# EAGLE board 32pins (EAGLE 6.6.0), part 1 of 3
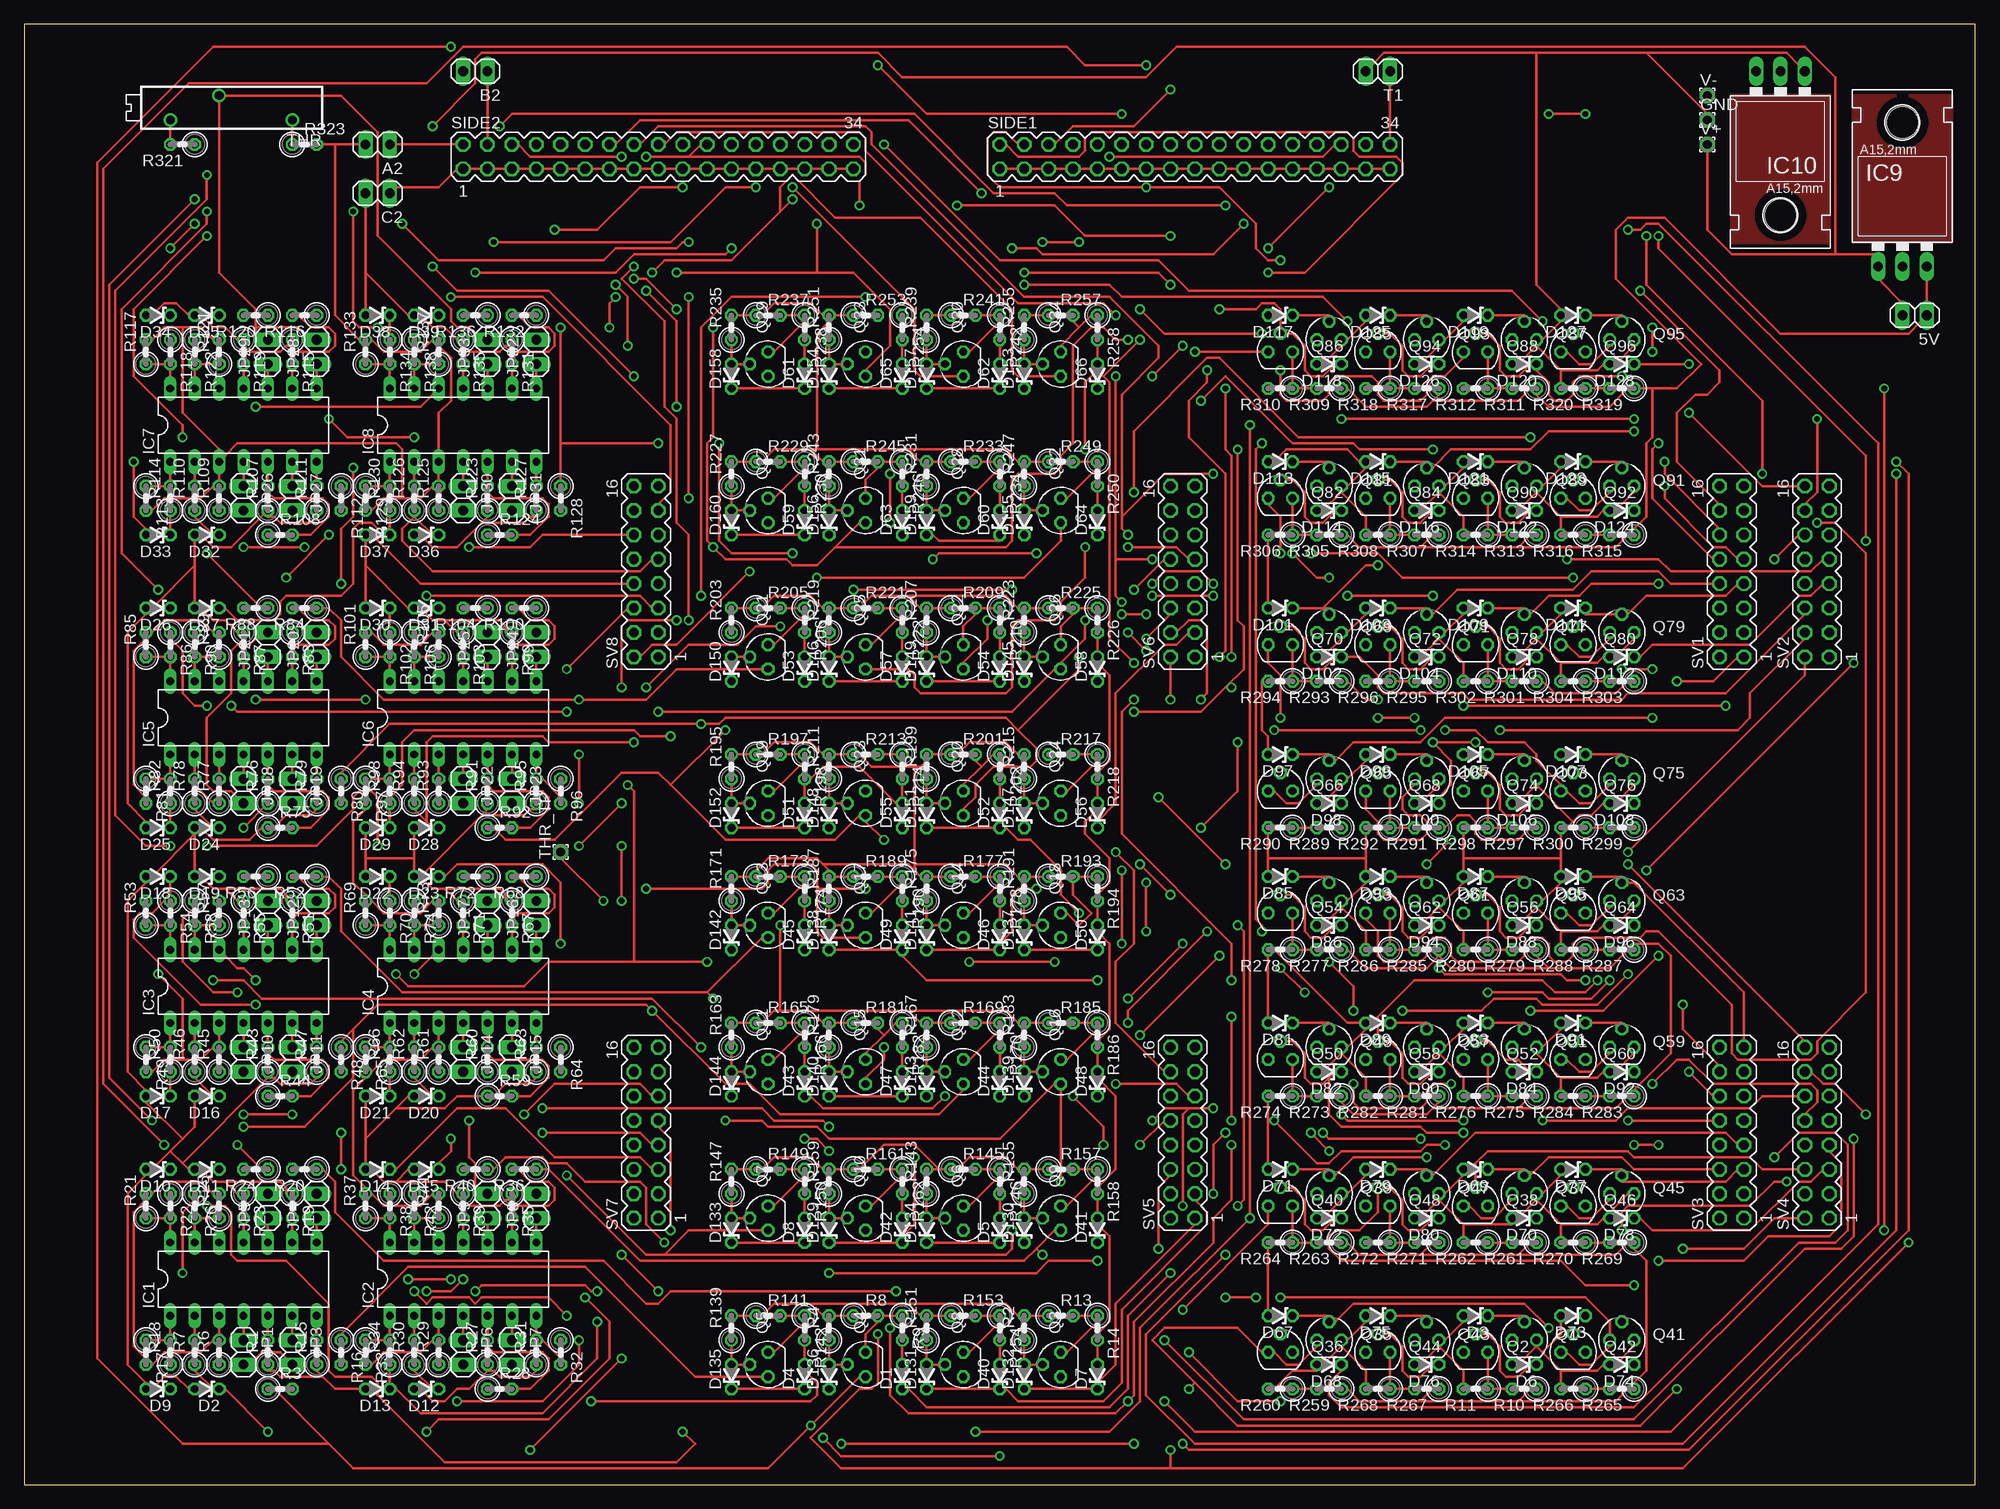
[diagram p4: board, top side]
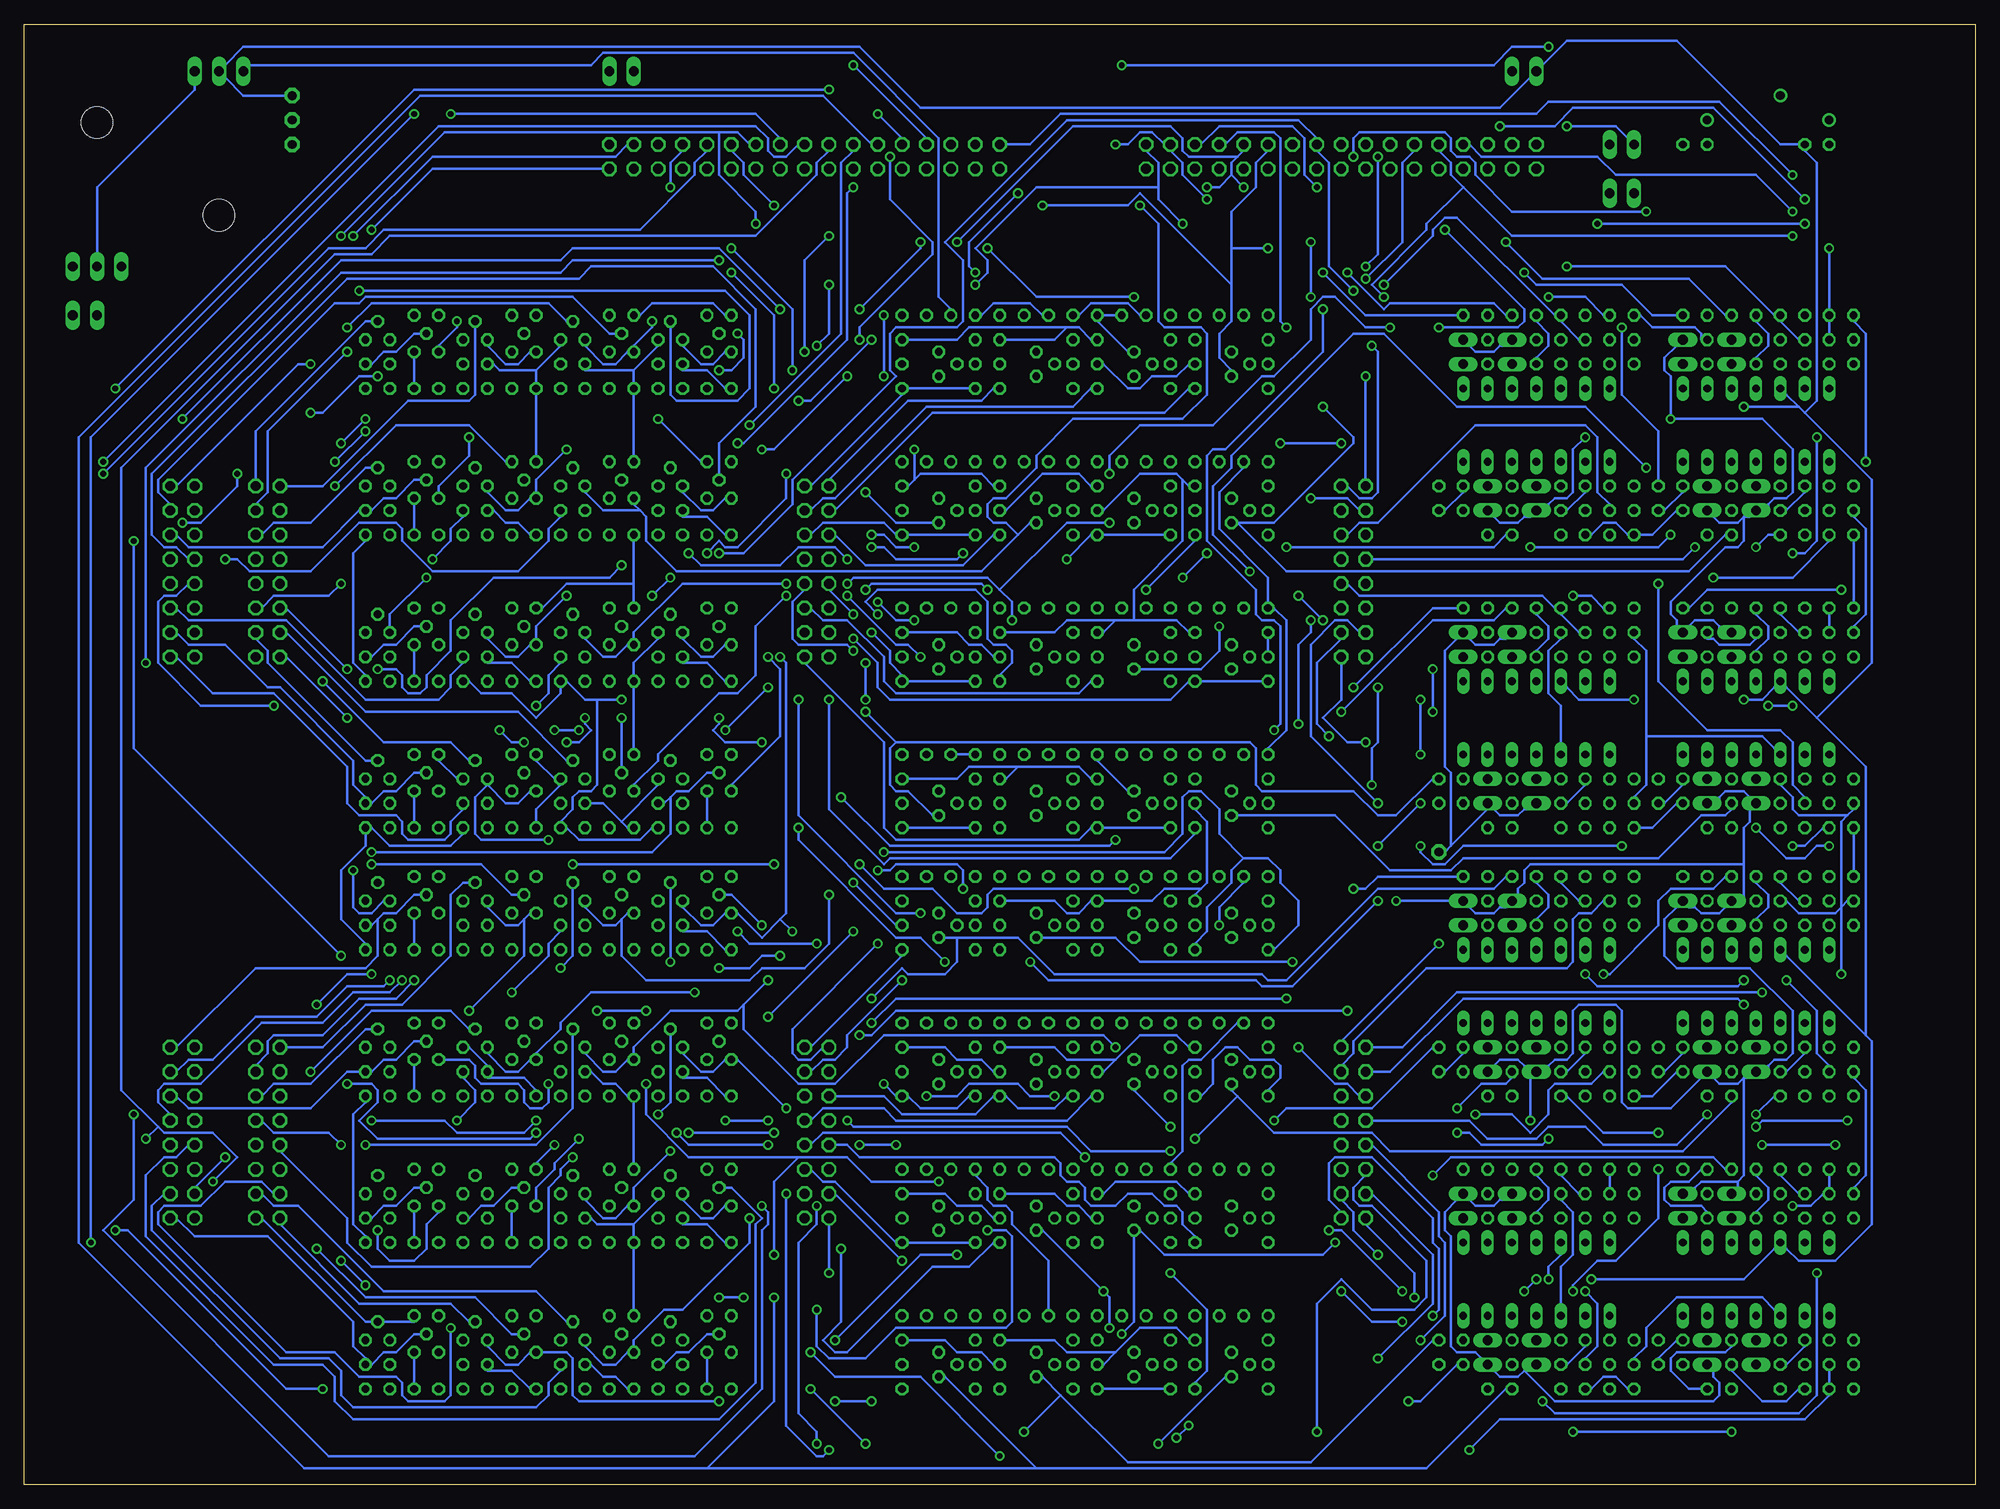
[diagram p5: board, bottom side, seen from below]

Size 203.18 x 152.07 mm. Coordinates in mm from the lower left corner, seen from the top.
Outline: 0,0 203.18,0 203.18,152.07 0,152.07 0,0
Copper layers (1*16): Top 0.035mm / dielectric 1.5mm / Bottom 0.035mm
Design rules "default": minimum track width 10mil, minimum drill 24mil, track to track 8mil, track to pad 8mil, pad to pad 8mil, via to via 8mil, smd to smd 8mil, copper to edge 40mil, drill to drill 8mil, minimum pad ring 10mil, minimum via ring 8mil, stop-mask expansion 4mil, vias tented up to drill 0mil, thermal gap 10mil

## Footprints (pad centres in the part's own frame; a part is rotated, then mirrored left to right if it is on the bottom)
1X02 = drill 1.016 long: 1 -1.27,0; 2 1.27,0
ZDIO-2.5 = drill 0.813 octagon: A 1.27,0; C -1.27,0
1,6/0,9 = drill 0.914 pad 1.6 octagon: 1 0,0
DIL14 = drill 0.813 long: 1 -7.62,-3.81; 2 -5.08,-3.81; 3 -2.54,-3.81; 4 0,-3.81; 5 2.54,-3.81; 6 5.08,-3.81; 7 7.62,-3.81; 8 7.62,3.81; 9 5.08,3.81; 10 2.54,3.81; 11 0,3.81; 12 -2.54,3.81; 13 -5.08,3.81; 14 -7.62,3.81
78XXL = drill 1.016 long: GND 0,-3.81; IN -2.54,-3.81; OUT 2.54,-3.81 | hole 3.302: 0,11.176
79XXL = drill 1.016 long: GND -2.54,-3.81; IN 0,-3.81; OUT 2.54,-3.81 | hole 3.302: 0,11.176
SOT54E = drill 0.813 octagon: D -1.27,0; G 0,1.905; S 1.27,0
0207/2V = drill 0.813 octagon: 1 -1.27,0; 2 1.27,0
MA17-2 = drill 1.016 octagon: 1 -20.32,-1.27; 2 -20.32,1.27; 3 -17.78,-1.27; 4 -17.78,1.27; 5 -15.24,-1.27; 6 -15.24,1.27; 7 -12.7,-1.27; 8 -12.7,1.27; 9 -10.16,-1.27; 10 -10.16,1.27; 11 -7.62,-1.27; 12 -7.62,1.27; 13 -5.08,-1.27; 14 -5.08,1.27; 15 -2.54,-1.27; 16 -2.54,1.27; 17 0,-1.27; 18 0,1.27; 19 2.54,-1.27; 20 2.54,1.27; 21 5.08,-1.27; 22 5.08,1.27; 23 7.62,-1.27; 24 7.62,1.27; 25 10.16,-1.27; 26 10.16,1.27; 27 12.7,-1.27; 28 12.7,1.27; 29 15.24,-1.27; 30 15.24,1.27; 31 17.78,-1.27; 32 17.78,1.27; 33 20.32,-1.27; 34 20.32,1.27
MA08-2 = drill 1.016 octagon: 1 -8.89,-1.27; 2 -8.89,1.27; 3 -6.35,-1.27; 4 -6.35,1.27; 5 -3.81,-1.27; 6 -3.81,1.27; 7 -1.27,-1.27; 8 -1.27,1.27; 9 1.27,-1.27; 10 1.27,1.27; 11 3.81,-1.27; 12 3.81,1.27; 13 6.35,-1.27; 14 6.35,1.27; 15 8.89,-1.27; 16 8.89,1.27
RTRIMT18 = drill 0.9: 1 -7.62,1.27; 2 0,-1.27; 3 5.08,1.27

## Placement (x,y rotation side)
5V  [1X02]  196.84,121.75 180 top
A2  [1X02]  36.82,139.53 180 top
B2  [1X02]  46.98,147.16 180 top
C2  [1X02]  36.82,134.46 180 top
D1  1N5229B  [ZDIO-2.5]  91.44,11.27 90 top
D2  1N5229B  [ZDIO-2.5]  19.05,10 180 top
D3  1N5229B  [ZDIO-2.5]  151.12,17.62 180 top
D4  1N5229B  [ZDIO-2.5]  81.28,11.27 90 top
D5  1N5229B  [ZDIO-2.5]  101.59,26.51 90 top
D6  1N5229B  [ZDIO-2.5]  156.21,12.54 180 top
D7  1N5229B  [ZDIO-2.5]  111.76,11.27 90 top
D8  1N5229B  [ZDIO-2.5]  81.28,26.51 90 top
D9  1N5229B  [ZDIO-2.5]  13.96,10 180 top
D10  1N5229B  [ZDIO-2.5]  13.96,32.86 180 top
D11  1N5229B  [ZDIO-2.5]  19.05,32.86 180 top
D12  1N5229B  [ZDIO-2.5]  41.9,10 180 top
D13  1N5229B  [ZDIO-2.5]  36.82,10 180 top
D14  1N5229B  [ZDIO-2.5]  36.82,32.86 180 top
D15  1N5229B  [ZDIO-2.5]  41.9,32.86 180 top
D16  1N5229B  [ZDIO-2.5]  19.05,40.48 180 top
D17  1N5229B  [ZDIO-2.5]  13.96,40.48 180 top
D18  1N5229B  [ZDIO-2.5]  13.96,63.34 180 top
D19  1N5229B  [ZDIO-2.5]  19.05,63.34 180 top
D20  1N5229B  [ZDIO-2.5]  41.9,40.48 180 top
D21  1N5229B  [ZDIO-2.5]  36.82,40.48 180 top
D22  1N5229B  [ZDIO-2.5]  36.82,63.34 180 top
D23  1N5229B  [ZDIO-2.5]  41.9,63.34 180 top
D24  1N5229B  [ZDIO-2.5]  19.05,68.41 180 top
D25  1N5229B  [ZDIO-2.5]  13.96,68.41 180 top
D26  1N5229B  [ZDIO-2.5]  13.96,91.27 180 top
D27  1N5229B  [ZDIO-2.5]  19.05,91.27 180 top
D28  1N5229B  [ZDIO-2.5]  41.9,68.41 180 top
D29  1N5229B  [ZDIO-2.5]  36.82,68.41 180 top
D30  1N5229B  [ZDIO-2.5]  36.82,91.27 180 top
D31  1N5229B  [ZDIO-2.5]  41.9,91.27 180 top
D32  1N5229B  [ZDIO-2.5]  19.05,98.89 180 top
D33  1N5229B  [ZDIO-2.5]  13.96,98.89 180 top
D34  1N5229B  [ZDIO-2.5]  13.96,121.75 180 top
D35  1N5229B  [ZDIO-2.5]  19.05,121.75 180 top
D36  1N5229B  [ZDIO-2.5]  41.9,98.89 180 top
D37  1N5229B  [ZDIO-2.5]  36.82,98.89 180 top
D38  1N5229B  [ZDIO-2.5]  36.82,121.75 180 top
D39  1N5229B  [ZDIO-2.5]  41.9,121.75 180 top
D40  1N5229B  [ZDIO-2.5]  101.59,11.27 90 top
D41  1N5229B  [ZDIO-2.5]  111.76,26.51 90 top
D42  1N5229B  [ZDIO-2.5]  91.44,26.51 90 top
D43  1N5229B  [ZDIO-2.5]  81.28,41.74 90 top
D44  1N5229B  [ZDIO-2.5]  101.59,41.74 90 top
D45  1N5229B  [ZDIO-2.5]  81.28,56.98 90 top
D46  1N5229B  [ZDIO-2.5]  101.59,56.98 90 top
D47  1N5229B  [ZDIO-2.5]  91.44,41.74 90 top
D48  1N5229B  [ZDIO-2.5]  111.76,41.74 90 top
D49  1N5229B  [ZDIO-2.5]  91.44,56.98 90 top
D50  1N5229B  [ZDIO-2.5]  111.76,56.98 90 top
D51  1N5229B  [ZDIO-2.5]  81.28,69.68 90 top
D52  1N5229B  [ZDIO-2.5]  101.59,69.68 90 top
D53  1N5229B  [ZDIO-2.5]  81.28,84.92 90 top
D54  1N5229B  [ZDIO-2.5]  101.59,84.92 90 top
D55  1N5229B  [ZDIO-2.5]  91.44,69.68 90 top
D56  1N5229B  [ZDIO-2.5]  111.76,69.68 90 top
D57  1N5229B  [ZDIO-2.5]  91.44,84.92 90 top
D58  1N5229B  [ZDIO-2.5]  111.76,84.92 90 top
D59  1N5229B  [ZDIO-2.5]  81.28,100.16 90 top
D60  1N5229B  [ZDIO-2.5]  101.59,100.16 90 top
D61  1N5229B  [ZDIO-2.5]  81.28,115.4 90 top
D62  1N5229B  [ZDIO-2.5]  101.59,115.4 90 top
D63  1N5229B  [ZDIO-2.5]  91.44,100.16 90 top
D64  1N5229B  [ZDIO-2.5]  111.76,100.16 90 top
D65  1N5229B  [ZDIO-2.5]  91.44,115.4 90 top
D66  1N5229B  [ZDIO-2.5]  111.76,115.4 90 top
D67  1N5229B  [ZDIO-2.5]  130.81,17.62 180 top
D68  1N5229B  [ZDIO-2.5]  135.88,12.54 180 top
D69  1N5229B  [ZDIO-2.5]  151.12,32.86 180 top
D70  1N5229B  [ZDIO-2.5]  156.21,27.78 180 top
D71  1N5229B  [ZDIO-2.5]  130.81,32.86 180 top
D72  1N5229B  [ZDIO-2.5]  135.88,27.78 180 top
D73  1N5229B  [ZDIO-2.5]  161.28,17.62 180 top
D74  1N5229B  [ZDIO-2.5]  166.37,12.54 180 top
D75  1N5229B  [ZDIO-2.5]  140.97,17.62 180 top
D76  1N5229B  [ZDIO-2.5]  146.05,12.54 180 top
D77  1N5229B  [ZDIO-2.5]  161.28,32.86 180 top
D78  1N5229B  [ZDIO-2.5]  166.37,27.78 180 top
D79  1N5229B  [ZDIO-2.5]  140.97,32.86 180 top
D80  1N5229B  [ZDIO-2.5]  146.05,27.78 180 top
D81  1N5229B  [ZDIO-2.5]  130.81,48.09 180 top
D82  1N5229B  [ZDIO-2.5]  135.88,43.02 180 top
D83  1N5229B  [ZDIO-2.5]  151.12,48.09 180 top
D84  1N5229B  [ZDIO-2.5]  156.21,43.02 180 top
D85  1N5229B  [ZDIO-2.5]  130.81,63.34 180 top
D86  1N5229B  [ZDIO-2.5]  135.88,58.26 180 top
D87  1N5229B  [ZDIO-2.5]  151.12,63.34 180 top
D88  1N5229B  [ZDIO-2.5]  156.21,58.26 180 top
D89  1N5229B  [ZDIO-2.5]  140.97,48.09 180 top
D90  1N5229B  [ZDIO-2.5]  146.05,43.02 180 top
D91  1N5229B  [ZDIO-2.5]  161.28,48.09 180 top
D92  1N5229B  [ZDIO-2.5]  166.37,43.02 180 top
D93  1N5229B  [ZDIO-2.5]  140.97,63.34 180 top
D94  1N5229B  [ZDIO-2.5]  146.05,58.26 180 top
D95  1N5229B  [ZDIO-2.5]  161.28,63.34 180 top
D96  1N5229B  [ZDIO-2.5]  166.37,58.26 180 top
D97  1N5229B  [ZDIO-2.5]  130.81,76.03 180 top
D98  1N5229B  [ZDIO-2.5]  135.88,70.95 180 top
D99  1N5229B  [ZDIO-2.5]  140.97,76.03 180 top
D100  1N5229B  [ZDIO-2.5]  146.05,70.95 180 top
D101  1N5229B  [ZDIO-2.5]  130.81,91.27 180 top
D102  1N5229B  [ZDIO-2.5]  135.88,86.19 180 top
D103  1N5229B  [ZDIO-2.5]  140.97,91.27 180 top
D104  1N5229B  [ZDIO-2.5]  146.05,86.19 180 top
D105  1N5229B  [ZDIO-2.5]  151.12,76.03 180 top
D106  1N5229B  [ZDIO-2.5]  156.21,70.95 180 top
D107  1N5229B  [ZDIO-2.5]  161.28,76.03 180 top
D108  1N5229B  [ZDIO-2.5]  166.37,70.95 180 top
D109  1N5229B  [ZDIO-2.5]  151.12,91.27 180 top
D110  1N5229B  [ZDIO-2.5]  156.21,86.19 180 top
D111  1N5229B  [ZDIO-2.5]  161.28,91.27 180 top
D112  1N5229B  [ZDIO-2.5]  166.37,86.19 180 top
D113  1N5229B  [ZDIO-2.5]  130.81,106.52 180 top
D114  1N5229B  [ZDIO-2.5]  135.88,101.43 180 top
D115  1N5229B  [ZDIO-2.5]  140.97,106.52 180 top
D116  1N5229B  [ZDIO-2.5]  146.05,101.43 180 top
D117  1N5229B  [ZDIO-2.5]  130.81,121.75 180 top
D118  1N5229B  [ZDIO-2.5]  135.88,116.67 180 top
D119  1N5229B  [ZDIO-2.5]  151.12,121.75 180 top
D120  1N5229B  [ZDIO-2.5]  156.21,116.67 180 top
D121  1N5229B  [ZDIO-2.5]  151.12,106.52 180 top
D122  1N5229B  [ZDIO-2.5]  156.21,101.43 180 top
D123  1N5229B  [ZDIO-2.5]  161.28,106.52 180 top
D124  1N5229B  [ZDIO-2.5]  166.37,101.43 180 top
D125  1N5229B  [ZDIO-2.5]  140.97,121.75 180 top
D126  1N5229B  [ZDIO-2.5]  146.05,116.67 180 top
D127  1N5229B  [ZDIO-2.5]  161.28,121.75 180 top
D128  1N5229B  [ZDIO-2.5]  166.37,116.67 180 top
D129  1N5225/3V  [ZDIO-2.5]  83.81,26.51 90 top
D130  1N5225/3V  [ZDIO-2.5]  104.14,26.51 90 top
D131  1N5225/3V  [ZDIO-2.5]  93.98,11.27 90 top
D132  1N5225/3V  [ZDIO-2.5]  104.14,11.27 90 top
D133  1N5225/3V  [ZDIO-2.5]  73.66,26.51 90 top
D134  1N5225/3V  [ZDIO-2.5]  93.98,26.51 90 top
D135  1N5225/3V  [ZDIO-2.5]  73.66,11.27 90 top
D136  1N5225/3V  [ZDIO-2.5]  83.81,11.27 90 top
D137  1N5225/3V  [ZDIO-2.5]  104.14,56.98 90 top
D138  1N5225/3V  [ZDIO-2.5]  83.81,56.98 90 top
D139  1N5225/3V  [ZDIO-2.5]  104.14,41.74 90 top
D140  1N5225/3V  [ZDIO-2.5]  83.81,41.74 90 top
D141  1N5225/3V  [ZDIO-2.5]  93.98,56.98 90 top
D142  1N5225/3V  [ZDIO-2.5]  73.66,56.98 90 top
D143  1N5225/3V  [ZDIO-2.5]  93.98,41.74 90 top
D144  1N5225/3V  [ZDIO-2.5]  73.66,41.74 90 top
D145  1N5225/3V  [ZDIO-2.5]  104.14,84.92 90 top
D146  1N5225/3V  [ZDIO-2.5]  83.81,84.92 90 top
D147  1N5225/3V  [ZDIO-2.5]  104.14,69.68 90 top
D148  1N5225/3V  [ZDIO-2.5]  83.81,69.68 90 top
D149  1N5225/3V  [ZDIO-2.5]  93.98,84.92 90 top
D150  1N5225/3V  [ZDIO-2.5]  73.66,84.92 90 top
D151  1N5225/3V  [ZDIO-2.5]  93.98,69.68 90 top
D152  1N5225/3V  [ZDIO-2.5]  73.66,69.68 90 top
D153  1N5225/3V  [ZDIO-2.5]  104.14,115.4 90 top
D154  1N5225/3V  [ZDIO-2.5]  83.81,115.4 90 top
D155  1N5225/3V  [ZDIO-2.5]  104.14,100.16 90 top
D156  1N5225/3V  [ZDIO-2.5]  83.81,100.16 90 top
D157  1N5225/3V  [ZDIO-2.5]  93.98,115.4 90 top
D158  1N5225/3V  [ZDIO-2.5]  73.66,115.4 90 top
D159  1N5225/3V  [ZDIO-2.5]  93.98,100.16 90 top
D160  1N5225/3V  [ZDIO-2.5]  73.66,100.16 90 top
GND  [1,6/0,9]  175.25,142.08 0 top
IC1  LM139N  [DIL14]  22.86,21.43 0 top
IC2  LM139N  [DIL14]  45.71,21.43 0 top
IC3  LM139N  [DIL14]  22.86,51.91 0 top
IC4  LM139N  [DIL14]  45.71,51.91 0 top
IC5  LM139N  [DIL14]  22.86,79.84 0 top
IC6  LM139N  [DIL14]  45.71,79.84 0 top
IC7  LM139N  [DIL14]  22.86,110.32 0 top
IC8  LM139N  [DIL14]  45.71,110.32 0 top
IC9  [78XXL]  195.58,130.65 0 top
IC10  [79XXL]  182.88,143.34 180 top
JP1  [1X02]  22.86,13.81 270 top
JP3  [1X02]  27.94,13.81 270 top
JP4  [1X02]  30.48,29.05 90 top
JP5  [1X02]  25.39,29.05 90 top
JP6  [1X02]  45.71,13.81 270 top
JP7  [1X02]  50.79,13.81 270 top
JP8  [1X02]  53.34,29.05 90 top
JP9  [1X02]  48.25,29.05 90 top
JP10  [1X02]  22.86,44.29 270 top
JP11  [1X02]  27.94,44.29 270 top
JP12  [1X02]  30.48,59.52 90 top
JP13  [1X02]  25.39,59.52 90 top
JP14  [1X02]  45.71,44.29 270 top
JP15  [1X02]  50.79,44.29 270 top
JP16  [1X02]  53.34,59.52 90 top
JP17  [1X02]  48.25,59.52 90 top
JP18  [1X02]  22.86,72.22 270 top
JP19  [1X02]  27.94,72.22 270 top
JP20  [1X02]  30.48,87.46 90 top
JP21  [1X02]  25.39,87.46 90 top
JP22  [1X02]  45.71,72.22 270 top
JP23  [1X02]  50.79,72.22 270 top
JP24  [1X02]  53.34,87.46 90 top
JP25  [1X02]  48.25,87.46 90 top
JP26  [1X02]  22.86,102.7 270 top
JP27  [1X02]  27.94,102.7 270 top
JP28  [1X02]  30.48,117.94 90 top
JP29  [1X02]  25.39,117.94 90 top
JP30  [1X02]  45.71,102.7 270 top
JP31  [1X02]  50.79,102.7 270 top
JP32  [1X02]  53.34,117.94 90 top
JP33  [1X02]  48.25,117.94 90 top
Q1  BS170  [SOT54E]  156.21,15.08 0 top
Q2  BS250  [SOT54E]  151.12,13.81 0 top
Q3  BS170  [SOT54E]  107.95,12.54 90 top
Q4  BS170  [SOT54E]  87.62,12.54 90 top
Q5  BS170  [SOT54E]  77.47,12.54 90 top
Q6  BS170  [SOT54E]  97.79,27.78 90 top
Q7  BS170  [SOT54E]  77.47,27.78 90 top
Q8  BS170  [SOT54E]  97.79,12.54 90 top
Q9  BS170  [SOT54E]  107.95,27.78 90 top
Q10  BS170  [SOT54E]  87.62,27.78 90 top
Q11  BS170  [SOT54E]  77.47,43.02 90 top
Q12  BS170  [SOT54E]  97.79,43.02 90 top
Q13  BS170  [SOT54E]  77.47,58.26 90 top
Q14  BS170  [SOT54E]  97.79,58.26 90 top
Q15  BS170  [SOT54E]  87.62,43.02 90 top
Q16  BS170  [SOT54E]  107.95,43.02 90 top
Q17  BS170  [SOT54E]  87.62,58.26 90 top
Q18  BS170  [SOT54E]  107.95,58.26 90 top
Q19  BS170  [SOT54E]  77.47,70.95 90 top
Q20  BS170  [SOT54E]  97.79,70.95 90 top
Q21  BS170  [SOT54E]  77.47,86.19 90 top
Q22  BS170  [SOT54E]  97.79,86.19 90 top
Q23  BS170  [SOT54E]  87.62,70.95 90 top
Q24  BS170  [SOT54E]  107.95,70.95 90 top
Q25  BS170  [SOT54E]  87.62,86.19 90 top
Q26  BS170  [SOT54E]  107.95,86.19 90 top
Q27  BS170  [SOT54E]  77.47,101.43 90 top
Q28  BS170  [SOT54E]  97.79,101.43 90 top
Q29  BS170  [SOT54E]  77.47,116.67 90 top
Q30  BS170  [SOT54E]  97.79,116.67 90 top
Q31  BS170  [SOT54E]  87.62,101.43 90 top
Q32  BS170  [SOT54E]  107.95,101.43 90 top
Q33  BS170  [SOT54E]  87.62,116.67 90 top
Q34  BS170  [SOT54E]  107.95,116.67 90 top
Q35  BS170  [SOT54E]  135.88,15.08 0 top
Q36  BS250  [SOT54E]  130.81,13.81 0 top
Q37  BS170  [SOT54E]  156.21,30.32 0 top
Q38  BS250  [SOT54E]  151.12,29.05 0 top
Q39  BS170  [SOT54E]  135.88,30.32 0 top
Q40  BS250  [SOT54E]  130.81,29.05 0 top
Q41  BS170  [SOT54E]  166.37,15.08 0 top
Q42  BS250  [SOT54E]  161.28,13.81 0 top
Q43  BS170  [SOT54E]  146.05,15.08 0 top
Q44  BS250  [SOT54E]  140.97,13.81 0 top
Q45  BS170  [SOT54E]  166.37,30.32 0 top
Q46  BS250  [SOT54E]  161.28,29.05 0 top
Q47  BS170  [SOT54E]  146.05,30.32 0 top
Q48  BS250  [SOT54E]  140.97,29.05 0 top
Q49  BS170  [SOT54E]  135.88,45.55 0 top
Q50  BS250  [SOT54E]  130.81,44.29 0 top
Q51  BS170  [SOT54E]  156.21,45.55 0 top
Q52  BS250  [SOT54E]  151.12,44.29 0 top
Q53  BS170  [SOT54E]  135.88,60.8 0 top
Q54  BS250  [SOT54E]  130.81,59.52 0 top
Q55  BS170  [SOT54E]  156.21,60.8 0 top
Q56  BS250  [SOT54E]  151.12,59.52 0 top
Q57  BS170  [SOT54E]  146.05,45.55 0 top
Q58  BS250  [SOT54E]  140.97,44.29 0 top
Q59  BS170  [SOT54E]  166.37,45.55 0 top
Q60  BS250  [SOT54E]  161.28,44.29 0 top
Q61  BS170  [SOT54E]  146.05,60.8 0 top
Q62  BS250  [SOT54E]  140.97,59.52 0 top
Q63  BS170  [SOT54E]  166.37,60.8 0 top
Q64  BS250  [SOT54E]  161.28,59.52 0 top
Q65  BS170  [SOT54E]  135.88,73.49 0 top
Q66  BS250  [SOT54E]  130.81,72.22 0 top
Q67  BS170  [SOT54E]  146.05,73.49 0 top
Q68  BS250  [SOT54E]  140.97,72.22 0 top
Q69  BS170  [SOT54E]  135.88,88.73 0 top
Q70  BS250  [SOT54E]  130.81,87.46 0 top
Q71  BS170  [SOT54E]  146.05,88.73 0 top
Q72  BS250  [SOT54E]  140.97,87.46 0 top
Q73  BS170  [SOT54E]  156.21,73.49 0 top
Q74  BS250  [SOT54E]  151.12,72.22 0 top
Q75  BS170  [SOT54E]  166.37,73.49 0 top
Q76  BS250  [SOT54E]  161.28,72.22 0 top
Q77  BS170  [SOT54E]  156.21,88.73 0 top
Q78  BS250  [SOT54E]  151.12,87.46 0 top
Q79  BS170  [SOT54E]  166.37,88.73 0 top
Q80  BS250  [SOT54E]  161.28,87.46 0 top
Q81  BS170  [SOT54E]  135.88,103.97 0 top
Q82  BS250  [SOT54E]  130.81,102.7 0 top
Q83  BS170  [SOT54E]  146.05,103.97 0 top
Q84  BS250  [SOT54E]  140.97,102.7 0 top
Q85  BS170  [SOT54E]  135.88,119.21 0 top
Q86  BS250  [SOT54E]  130.81,117.94 0 top
Q87  BS170  [SOT54E]  156.21,119.21 0 top
Q88  BS250  [SOT54E]  151.12,117.94 0 top
Q89  BS170  [SOT54E]  156.21,103.97 0 top
Q90  BS250  [SOT54E]  151.12,102.7 0 top
Q91  BS170  [SOT54E]  166.37,103.97 0 top
Q92  BS250  [SOT54E]  161.28,102.7 0 top
Q93  BS170  [SOT54E]  146.05,119.21 0 top
Q94  BS250  [SOT54E]  140.97,117.94 0 top
Q95  BS170  [SOT54E]  166.37,119.21 0 top
Q96  BS250  [SOT54E]  161.28,117.94 0 top
R1  27K  [0207/2V]  25.39,13.81 90 top
R2  5K  [0207/2V]  104.14,16.35 90 top
R3  75K  [0207/2V]  26.67,10 0 top
R4  5K  [0207/2V]  83.81,16.35 90 top
R6  5K  [0207/2V]  20.32,13.81 90 top
R7  5K  [0207/2V]  17.78,13.81 90 top
R8  5K  [0207/2V]  87.62,17.62 0 top
R9  10K  [0207/2V]  91.44,16.35 270 top
R10  5K  [0207/2V]  156.21,10 180 top
R11  10K  [0207/2V]  151.12,10 180 top
R13  5K  [0207/2V]  107.95,17.62 0 top
R14  10K  [0207/2V]  111.76,16.35 270 top
R15  27K  [0207/2V]  30.48,13.81 90 top
R16  75K  [0207/2V]  33.02,13.81 270 top
R17  5K  [0207/2V]  12.69,13.81 270 top
R18  5K  [0207/2V]  15.23,13.81 90 top
R19  27K  [0207/2V]  27.94,29.05 270 top
R20  75K  [0207/2V]  29.21,32.86 180 top
R21  5K  [0207/2V]  12.69,29.05 90 top
R22  5K  [0207/2V]  15.23,29.05 270 top
R23  27K  [0207/2V]  22.86,29.05 270 top
R24  75K  [0207/2V]  24.12,32.86 180 top
R25  5K  [0207/2V]  20.32,29.05 90 top
R26  5K  [0207/2V]  17.78,29.05 270 top
R27  27K  [0207/2V]  48.25,13.81 90 top
R28  75K  [0207/2V]  49.52,10 0 top
R29  5K  [0207/2V]  43.17,13.81 90 top
R30  5K  [0207/2V]  40.63,13.81 90 top
R31  27K  [0207/2V]  53.34,13.81 90 top
R32  75K  [0207/2V]  55.88,13.81 270 top
R33  5K  [0207/2V]  35.55,13.81 270 top
R34  5K  [0207/2V]  38.09,13.81 90 top
R35  27K  [0207/2V]  50.79,29.05 270 top
R36  75K  [0207/2V]  52.06,32.86 180 top
R37  5K  [0207/2V]  35.55,29.05 90 top
R38  5K  [0207/2V]  38.09,29.05 270 top
R39  27K  [0207/2V]  45.71,29.05 270 top
R40  75K  [0207/2V]  46.98,32.86 180 top
R41  5K  [0207/2V]  43.17,29.05 90 top
R42  5K  [0207/2V]  40.63,29.05 270 top
R43  27K  [0207/2V]  25.39,44.29 90 top
R44  75K  [0207/2V]  26.67,40.48 0 top
R45  5K  [0207/2V]  20.32,44.29 90 top
R46  5K  [0207/2V]  17.78,44.29 90 top
R47  27K  [0207/2V]  30.48,44.29 90 top
R48  75K  [0207/2V]  33.02,44.29 270 top
R49  5K  [0207/2V]  12.69,44.29 270 top
R50  5K  [0207/2V]  15.23,44.29 90 top
R51  27K  [0207/2V]  27.94,59.52 270 top
R52  75K  [0207/2V]  29.21,63.34 180 top
R53  5K  [0207/2V]  12.69,59.52 90 top
R54  5K  [0207/2V]  15.23,59.52 270 top
R55  27K  [0207/2V]  22.86,59.52 270 top
R56  75K  [0207/2V]  24.12,63.34 180 top
R57  5K  [0207/2V]  20.32,59.52 90 top
R58  5K  [0207/2V]  17.78,59.52 270 top
R59  27K  [0207/2V]  49.52,40.48 0 top
R60  75K  [0207/2V]  48.25,44.29 90 top
R61  5K  [0207/2V]  43.17,44.29 90 top
R62  5K  [0207/2V]  40.63,44.29 90 top
R63  27K  [0207/2V]  53.34,44.29 90 top
R64  75K  [0207/2V]  55.88,44.29 270 top
R65  5K  [0207/2V]  35.55,44.29 270 top
R66  5K  [0207/2V]  38.09,44.29 90 top
R67  27K  [0207/2V]  50.79,59.52 270 top
R68  75K  [0207/2V]  52.06,63.34 180 top
R69  5K  [0207/2V]  35.55,59.52 90 top
R70  5K  [0207/2V]  38.09,59.52 270 top
R71  27K  [0207/2V]  45.71,59.52 270 top
R72  75K  [0207/2V]  46.98,63.34 180 top
R73  5K  [0207/2V]  43.17,59.52 90 top
R74  5K  [0207/2V]  40.63,59.52 270 top
R75  27K  [0207/2V]  26.67,68.41 0 top
R76  75K  [0207/2V]  25.39,72.22 90 top
R77  5K  [0207/2V]  20.32,72.22 90 top
R78  5K  [0207/2V]  17.78,72.22 90 top
R79  27K  [0207/2V]  30.48,72.22 90 top
R80  75K  [0207/2V]  33.02,72.22 270 top
R81  5K  [0207/2V]  12.69,72.22 270 top
R82  5K  [0207/2V]  15.23,72.22 90 top
R83  27K  [0207/2V]  27.94,87.46 270 top
R84  75K  [0207/2V]  29.21,91.27 180 top
R85  5K  [0207/2V]  12.69,87.46 90 top
R86  5K  [0207/2V]  15.23,87.46 270 top
R87  27K  [0207/2V]  22.86,87.46 270 top
R88  75K  [0207/2V]  24.12,91.27 180 top
R89  5K  [0207/2V]  20.32,87.46 90 top
R90  5K  [0207/2V]  17.78,87.46 270 top
R91  27K  [0207/2V]  48.25,72.22 90 top
R92  75K  [0207/2V]  49.52,68.41 0 top
R93  5K  [0207/2V]  43.17,72.22 90 top
R94  5K  [0207/2V]  40.63,72.22 90 top
R95  27K  [0207/2V]  53.34,72.22 90 top
R96  75K  [0207/2V]  55.88,72.22 270 top
R97  5K  [0207/2V]  35.55,72.22 270 top
R98  5K  [0207/2V]  38.09,72.22 90 top
R99  27K  [0207/2V]  50.79,87.46 270 top
R100  75K  [0207/2V]  52.06,91.27 180 top
R101  5K  [0207/2V]  35.55,87.46 90 top
R102  5K  [0207/2V]  38.09,87.46 270 top
R103  27K  [0207/2V]  45.71,87.46 270 top
R104  75K  [0207/2V]  46.98,91.27 180 top
R105  5K  [0207/2V]  43.17,87.46 90 top
R106  5K  [0207/2V]  40.63,87.46 270 top
R107  27K  [0207/2V]  25.39,102.7 90 top
R108  75K  [0207/2V]  26.67,98.89 0 top
R109  5K  [0207/2V]  20.32,102.7 90 top
R110  5K  [0207/2V]  17.78,102.7 90 top
R111  27K  [0207/2V]  30.48,102.7 90 top
R112  75K  [0207/2V]  33.02,102.7 270 top
R113  5K  [0207/2V]  12.69,102.7 270 top
R114  5K  [0207/2V]  15.23,102.7 90 top
R115  27K  [0207/2V]  27.94,117.94 270 top
R116  75K  [0207/2V]  29.21,121.75 180 top
R117  5K  [0207/2V]  12.69,117.94 90 top
R118  5K  [0207/2V]  15.23,117.94 270 top
R119  27K  [0207/2V]  22.86,117.94 270 top
R120  75K  [0207/2V]  24.12,121.75 180 top
R121  5K  [0207/2V]  20.32,117.94 90 top
R122  5K  [0207/2V]  17.78,117.94 270 top
R123  27K  [0207/2V]  48.25,102.7 90 top
R124  75K  [0207/2V]  49.52,98.89 0 top
R125  5K  [0207/2V]  43.17,102.7 90 top
R126  5K  [0207/2V]  40.63,102.7 90 top
R127  27K  [0207/2V]  53.34,102.7 90 top
R128  75K  [0207/2V]  55.88,102.7 270 top
R129  5K  [0207/2V]  35.55,102.7 270 top
R130  5K  [0207/2V]  38.09,102.7 90 top
R131  27K  [0207/2V]  50.79,117.94 270 top
R132  75K  [0207/2V]  52.06,121.75 180 top
R133  5K  [0207/2V]  35.55,117.94 90 top
R134  5K  [0207/2V]  38.09,117.94 270 top
R135  27K  [0207/2V]  45.71,117.94 270 top
R136  75K  [0207/2V]  46.98,121.75 180 top
R137  5K  [0207/2V]  43.17,117.94 90 top
R138  5K  [0207/2V]  40.63,117.94 270 top
R139  5K  [0207/2V]  73.66,16.35 90 top
R141  5K  [0207/2V]  77.47,17.62 0 top
R142  10K  [0207/2V]  81.28,16.35 270 top
R143  5K  [0207/2V]  93.98,31.59 90 top
R145  5K  [0207/2V]  97.79,32.86 0 top
R146  10K  [0207/2V]  101.59,31.59 270 top
R147  5K  [0207/2V]  73.66,31.59 90 top
R149  5K  [0207/2V]  77.47,32.86 0 top
R150  10K  [0207/2V]  81.28,31.59 270 top
R151  5K  [0207/2V]  93.98,16.35 90 top
R153  5K  [0207/2V]  97.79,17.62 0 top
R154  10K  [0207/2V]  101.59,16.35 270 top
R155  5K  [0207/2V]  104.14,31.59 90 top
R157  5K  [0207/2V]  107.95,32.86 0 top
R158  10K  [0207/2V]  111.76,31.59 270 top
R159  5K  [0207/2V]  83.81,31.59 90 top
R161  5K  [0207/2V]  87.62,32.86 0 top
R162  10K  [0207/2V]  91.44,31.59 270 top
R163  5K  [0207/2V]  73.66,46.83 90 top
R165  5K  [0207/2V]  77.47,48.09 0 top
R166  10K  [0207/2V]  81.28,46.83 270 top
R167  5K  [0207/2V]  93.98,46.83 90 top
R169  5K  [0207/2V]  97.79,48.09 0 top
R170  10K  [0207/2V]  101.59,46.83 270 top
R171  5K  [0207/2V]  73.66,62.06 90 top
R173  5K  [0207/2V]  77.47,63.34 0 top
R174  10K  [0207/2V]  81.28,62.06 270 top
R175  5K  [0207/2V]  93.98,62.06 90 top
R177  5K  [0207/2V]  97.79,63.34 0 top
R178  10K  [0207/2V]  101.59,62.06 270 top
R179  5K  [0207/2V]  83.81,46.83 90 top
R181  5K  [0207/2V]  87.62,48.09 0 top
R182  10K  [0207/2V]  91.44,46.83 270 top
R183  5K  [0207/2V]  104.14,46.83 90 top
R185  5K  [0207/2V]  107.95,48.09 0 top
R186  10K  [0207/2V]  111.76,46.83 270 top
R187  5K  [0207/2V]  83.81,62.06 90 top
R189  5K  [0207/2V]  87.62,63.34 0 top
R190  10K  [0207/2V]  91.44,62.06 270 top
R191  5K  [0207/2V]  104.14,62.06 90 top
R193  5K  [0207/2V]  107.95,63.34 0 top
R194  10K  [0207/2V]  111.76,62.06 270 top
R195  5K  [0207/2V]  73.66,74.77 90 top
R197  5K  [0207/2V]  77.47,76.03 0 top
R198  10K  [0207/2V]  81.28,74.77 270 top
R199  5K  [0207/2V]  93.98,74.77 90 top
R201  5K  [0207/2V]  97.79,76.03 0 top
R202  10K  [0207/2V]  101.59,74.77 270 top
R203  5K  [0207/2V]  73.66,90 90 top
R205  5K  [0207/2V]  77.47,91.27 0 top
R206  10K  [0207/2V]  81.28,90 270 top
R207  5K  [0207/2V]  93.98,90 90 top
R209  5K  [0207/2V]  97.79,91.27 0 top
R210  10K  [0207/2V]  101.59,90 270 top
R211  5K  [0207/2V]  83.81,74.77 90 top
R213  5K  [0207/2V]  87.62,76.03 0 top
R214  10K  [0207/2V]  91.44,74.77 270 top
R215  5K  [0207/2V]  104.14,74.77 90 top
R217  5K  [0207/2V]  107.95,76.03 0 top
R218  10K  [0207/2V]  111.76,74.77 270 top
R219  5K  [0207/2V]  83.81,90 90 top
R221  5K  [0207/2V]  87.62,91.27 0 top
R222  10K  [0207/2V]  91.44,90 270 top
R223  5K  [0207/2V]  104.14,90 90 top
R225  5K  [0207/2V]  107.95,91.27 0 top
R226  10K  [0207/2V]  111.76,90 270 top
R227  5K  [0207/2V]  73.66,105.24 90 top
R229  5K  [0207/2V]  77.47,106.52 0 top
R230  10K  [0207/2V]  81.28,105.24 270 top
R231  5K  [0207/2V]  93.98,105.24 90 top
R233  5K  [0207/2V]  97.79,106.52 0 top
R234  10K  [0207/2V]  101.59,105.24 270 top
R235  5K  [0207/2V]  73.66,120.48 90 top
R237  5K  [0207/2V]  77.47,121.75 0 top
R238  10K  [0207/2V]  81.28,120.48 270 top
R239  5K  [0207/2V]  93.98,120.48 90 top
R241  5K  [0207/2V]  97.79,121.75 0 top
R242  10K  [0207/2V]  101.59,120.48 270 top
R243  5K  [0207/2V]  83.81,105.24 90 top
R245  5K  [0207/2V]  87.62,106.52 0 top
R246  10K  [0207/2V]  91.44,105.24 270 top
R247  5K  [0207/2V]  104.14,105.24 90 top
R249  5K  [0207/2V]  107.95,106.52 0 top
R250  10K  [0207/2V]  111.76,105.24 270 top
R251  5K  [0207/2V]  83.81,120.48 90 top
R253  5K  [0207/2V]  87.62,121.75 0 top
R254  10K  [0207/2V]  91.44,120.48 270 top
R255  5K  [0207/2V]  104.14,120.48 90 top
R257  5K  [0207/2V]  107.95,121.75 0 top
R258  10K  [0207/2V]  111.76,120.48 270 top
R259  5K  [0207/2V]  135.88,10 180 top
R260  10K  [0207/2V]  130.81,10 180 top
R261  5K  [0207/2V]  156.21,25.23 180 top
R262  10K  [0207/2V]  151.12,25.23 180 top
R263  5K  [0207/2V]  135.88,25.23 180 top
R264  10K  [0207/2V]  130.81,25.23 180 top
R265  5K  [0207/2V]  166.37,10 180 top
R266  10K  [0207/2V]  161.28,10 180 top
R267  5K  [0207/2V]  146.05,10 180 top
R268  10K  [0207/2V]  140.97,10 180 top
R269  5K  [0207/2V]  166.37,25.23 180 top
R270  10K  [0207/2V]  161.28,25.23 180 top
R271  5K  [0207/2V]  146.05,25.23 180 top
R272  10K  [0207/2V]  140.97,25.23 180 top
R273  5K  [0207/2V]  135.88,40.48 180 top
R274  10K  [0207/2V]  130.81,40.48 180 top
R275  5K  [0207/2V]  156.21,40.48 180 top
R276  10K  [0207/2V]  151.12,40.48 180 top
R277  5K  [0207/2V]  135.88,55.72 180 top
R278  10K  [0207/2V]  130.81,55.72 180 top
R279  5K  [0207/2V]  156.21,55.72 180 top
R280  10K  [0207/2V]  151.12,55.72 180 top
R281  5K  [0207/2V]  146.05,40.48 180 top
R282  10K  [0207/2V]  140.97,40.48 180 top
R283  5K  [0207/2V]  166.37,40.48 180 top
R284  10K  [0207/2V]  161.28,40.48 180 top
R285  5K  [0207/2V]  146.05,55.72 180 top
R286  10K  [0207/2V]  140.97,55.72 180 top
R287  5K  [0207/2V]  166.37,55.72 180 top
R288  10K  [0207/2V]  161.28,55.72 180 top
R289  5K  [0207/2V]  135.88,68.41 180 top
R290  10K  [0207/2V]  130.81,68.41 180 top
R291  5K  [0207/2V]  146.05,68.41 180 top
R292  10K  [0207/2V]  140.97,68.41 180 top
R293  5K  [0207/2V]  135.88,83.65 180 top
R294  10K  [0207/2V]  130.81,83.65 180 top
R295  5K  [0207/2V]  146.05,83.65 180 top
R296  10K  [0207/2V]  140.97,83.65 180 top
R297  5K  [0207/2V]  156.21,68.41 180 top
R298  10K  [0207/2V]  151.12,68.41 180 top
R299  5K  [0207/2V]  166.37,68.41 180 top
R300  10K  [0207/2V]  161.28,68.41 180 top
R301  5K  [0207/2V]  156.21,83.65 180 top
R302  10K  [0207/2V]  151.12,83.65 180 top
R303  5K  [0207/2V]  166.37,83.65 180 top
R304  10K  [0207/2V]  161.28,83.65 180 top
R305  5K  [0207/2V]  135.88,98.89 180 top
R306  10K  [0207/2V]  130.81,98.89 180 top
R307  5K  [0207/2V]  146.05,98.89 180 top
R308  10K  [0207/2V]  140.97,98.89 180 top
R309  5K  [0207/2V]  135.88,114.13 180 top
R310  10K  [0207/2V]  130.81,114.13 180 top
R311  5K  [0207/2V]  156.21,114.13 180 top
R312  10K  [0207/2V]  151.12,114.13 180 top
R313  5K  [0207/2V]  156.21,98.89 180 top
R314  10K  [0207/2V]  151.12,98.89 180 top
R315  5K  [0207/2V]  166.37,98.89 180 top
R316  10K  [0207/2V]  161.28,98.89 180 top
R317  5K  [0207/2V]  146.05,114.13 180 top
R318  10K  [0207/2V]  140.97,114.13 180 top
R319  5K  [0207/2V]  166.37,114.13 180 top
R320  10K  [0207/2V]  161.28,114.13 180 top
R321  [0207/2V]  16.51,139.53 180 top
R323  [0207/2V]  29.21,139.53 0 top
SIDE1  [MA17-2]  121.92,138.27 0 top
SIDE2  [MA17-2]  66.04,138.27 0 top
SV1  [MA08-2]  177.8,95.08 90 top
SV2  [MA08-2]  186.69,95.08 90 top
SV3  [MA08-2]  177.8,36.66 90 top
SV4  [MA08-2]  186.69,36.66 90 top
SV5  [MA08-2]  120.65,36.66 90 top
SV6  [MA08-2]  120.65,95.08 90 top
SV7  [MA08-2]  64.77,36.66 90 top
SV8  [MA08-2]  64.77,95.08 90 top
T1  [1X02]  140.97,147.16 180 top
THR  [RTRIMT18]  20.32,143.34 180 top
THR_TP  [1,6/0,9]  55.88,65.88 90 top
V+  [1,6/0,9]  175.25,139.53 0 top
V-  [1,6/0,9]  175.25,144.62 0 top

## Tracks (layer width: path | path; a pad name or v marks a point on that pad's centre or on a via)
!PUA1  (via drill 0.61)
  Top 0.254: Q2.G 151.76,15.71 152.4,15.71 153.66,14.44 153.66,11.9 154.3,11.27 155.57,11.27 156.84,12.54 D6.C | v172.72,24.6 179.06,24.6 182.24,27.78 184.78,27.78 SV4.2
  Bottom 0.254: v172.72,24.6 167.63,19.52 156.21,19.52 152.4,15.71 151.76,15.71 Q2.G
!PUB1  (via drill 0.61)
  Top 0.254: v182.24,34.12 184.78,36.66 188.59,36.66 189.86,35.4 189.86,26.51 188.59,25.23 184.78,25.23 167.63,8.09 137.16,8.09 135.88,9.36 135.88,10.63 137.16,11.9 D68.C
  Bottom 0.254: Q36.G 131.44,15.71 132.08,15.71 133.98,13.81 135.25,13.81 136.52,12.54 D68.C | v182.24,34.12 185.41,30.95 SV4.4
!PUC1
  Top 0.254: SV4.6 184.78,32.86 180.97,32.86 179.7,34.12 167.63,34.12 167,34.76 152.4,34.76 151.12,33.49 151.12,31.59 Q38.G
  Bottom 0.254: Q38.G 151.76,30.95 152.4,30.95 154.3,29.05 155.57,29.05 156.84,27.78 D70.C
!PUD1
  Top 0.254: Q40.G 131.44,30.95 132.08,30.95 133.34,29.68 133.34,27.14 133.98,26.51 135.25,26.51 136.52,27.78 D72.C
  Bottom 0.254: SV4.8 186.05,35.4 187.32,34.12 188.59,34.12 190.5,32.22 190.5,25.87 177.16,12.54 172.08,12.54 170.81,11.27 170.81,8.73 168.91,6.82 130.81,6.82 127,10.63 127,27.14 126.36,27.78 129.53,30.95 130.17,30.95 Q40.G
!PUD2  (via drill 0.61)
  Top 0.254: v144.78,79.84 v140.97,79.84 | D100.C 147.31,71.59 148.59,72.86 148.59,75.4 v146.68,77.3 v151.12,77.3 | v153.66,78.57 178.43,78.57 179.7,79.84 179.7,82.38 185.41,88.1 SV2.4
  Bottom 0.254: v140.97,79.84 140.97,74.77 Q68.G | v144.78,79.84 144.78,79.21 144.14,78.57 145.41,77.3 v146.68,77.3 | v153.66,78.57 152.4,77.3 v151.12,77.3
!PUE1
  Bottom 0.254: Q42.G 161.92,15.71 162.56,15.71 164.46,13.81 165.73,13.81 167,12.54 D74.C 167.63,13.17 168.91,14.44 168.91,16.98 177.8,25.87 185.41,25.87 187.32,27.78 SV4.1
!PUE2
  Top 0.254: Q70.G 131.44,89.37 132.08,89.37 133.34,88.1 133.34,85.56 133.98,84.92 135.25,84.92 136.52,86.19 D102.C 137.79,86.19 139.06,86.19 140.97,84.29 140.97,83.02 141.6,82.38 149.86,82.38 150.49,81.75 166.37,81.75 167,82.38 177.16,82.38 185.41,90.64 SV2.6
!PUF1
  Top 0.254: Q44.G 141.6,15.71 142.24,15.71 143.5,14.44 143.5,11.9 144.14,11.27 145.41,11.27 146.68,12.54 D76.C
  Bottom 0.254: SV4.3 188.59,30.32 189.86,29.05 189.86,26.51 176.53,13.17 171.44,13.17 170.18,11.9 170.18,9.36 168.91,8.09 149.86,8.09 148.59,9.36 148.59,10.63 147.31,11.9 D76.C
!PUF2  (via drill 0.61)
  Top 0.254: Q72.G 141.6,89.37 142.24,89.37 143.5,88.1 143.5,85.56 144.14,84.92 145.41,84.92 146.68,86.19 D104.C | v177.16,81.11 v149.86,81.11
  Bottom 0.254: v177.16,81.11 184.78,81.11 189.22,85.56 189.22,91.91 188.59,92.54 187.32,92.54 186.05,93.81 SV2.8 | v149.86,81.11 148.59,82.38 148.59,84.29 147.31,85.56 D104.C
!PUH1
  Top 0.254: SV4.5 187.32,32.86 186.05,31.59 184.78,31.59 179.7,26.51 169.54,26.51 168.27,27.78 D78.C
  Bottom 0.254: Q46.G 161.92,30.95 162.56,30.95 164.46,29.05 165.73,29.05 167,27.78 D78.C
!PUH2
  Top 0.254: D106.C 156.84,70.95 155.57,69.68 154.3,69.68 153.66,70.32 153.66,72.86 152.4,74.13 151.76,74.13 Q74.G
  Bottom 0.254: SV2.1 187.32,86.19 183.51,82.38 177.16,82.38 169.54,74.77 169.54,70.95 168.27,69.68 164.46,69.68 163.83,69.05 163.83,67.78 163.19,67.14 159.38,67.14 158.75,67.78 158.75,69.05 157.47,70.32 D106.C
!PUJ1  (via drill 0.61)
  Top 0.254: D80.C 146.68,27.78 145.41,26.51 144.14,26.51 143.5,27.14 143.5,29.68 142.24,30.95 141.6,30.95 Q48.G 140.97,30.32 140.97,28.41 139.06,26.51 136.52,26.51 135.88,25.87 135.88,24.6 137.16,23.33 160.02,23.33 162.56,20.79 v167.63,20.79 | v170.18,23.33 179.06,23.33 181.61,25.87 187.96,25.87 189.22,27.14 189.22,33.49 187.96,34.76 SV4.7
  Bottom 0.254: v167.63,20.79 v170.18,23.33
!PUJ2
  Bottom 0.254: Q76.G 161.92,74.13 162.56,74.13 164.46,72.22 165.73,72.22 167,70.95 D108.C 167.63,71.59 168.91,72.86 168.91,75.4 176.53,83.02 177.8,83.02 182.24,87.46 186.05,87.46 187.32,88.73 SV2.3
!PUK1  (via drill 0.61)
  Top 0.254: 135.88,42.38 136.52,43.02 D82.C | 135.88,42.38 135.25,41.74 133.98,41.74 133.34,42.38 133.34,44.92 132.08,46.19 131.44,46.19 Q50.G | v169.54,41.74 172.08,44.29 173.35,44.29 175.89,41.74 186.05,41.74 186.69,41.11 186.69,39.84 185.41,38.57 SV4.10 | v149.86,36.66 146.05,36.66 145.41,37.3 137.16,37.3 135.88,38.57 135.88,42.38
  Bottom 0.254: v169.54,41.74 167,41.74 166.37,41.11 166.37,39.84 168.27,37.94 166.37,36.03 150.49,36.03 v149.86,36.66
!PUK2
  Top 0.254: Q78.G 151.76,89.37 152.4,89.37 153.66,88.1 153.66,85.56 154.3,84.92 155.57,84.92 156.84,86.19 D110.C
  Bottom 0.254: SV2.5 187.32,91.27 186.05,90 175.89,90 167.63,81.75 160.02,81.75 158.75,83.02 158.75,84.29 157.47,85.56 D110.C
!PUL1  (via drill 0.61)
  Top 0.254: Q52.G 151.76,46.19 152.4,46.19 154.3,44.29 155.57,44.29 156.84,43.02 D84.C | v158.11,37.94 165.73,37.94 167,39.2 179.7,39.2 180.97,40.48 184.78,40.48 SV4.12
  Bottom 0.254: v158.11,37.94 156.21,39.84 156.21,41.11 157.47,42.38 D84.C
!PUL2
  Top 0.254: SV2.7 187.32,93.81 186.05,92.54 184.78,92.54 179.7,87.46 169.54,87.46 168.27,86.19 D112.C
  Bottom 0.254: Q80.G 161.92,89.37 162.56,89.37 164.46,87.46 165.73,87.46 167,86.19 D112.C
!PUM1  (via drill 0.61)
  Top 0.254: Q54.G 131.44,61.43 132.08,61.43 133.34,60.16 133.34,57.62 133.98,56.98 135.25,56.98 136.52,58.26 D86.C | v191.77,38.57 188.59,41.74 187.32,41.74 186.05,43.02 SV4.14 | v126.36,29.05 127,29.68 127,57.62 v126.36,58.26
  Bottom 0.254: v191.77,38.57 191.77,29.68 194.94,26.51 171.44,3.01 133.34,3.01 126.36,10 126.36,26.51 125.73,27.14 125.73,28.41 v126.36,29.05 | v126.36,58.26 129.53,61.43 130.17,61.43 Q54.G
!PUM2
  Top 0.254: Q82.G 131.44,104.61 132.08,104.61 133.34,103.34 133.34,100.8 133.98,100.16 135.25,100.16 136.52,101.43 D114.C
  Bottom 0.254: SV2.10 186.05,96.35 187.32,97.62 188.59,97.62 189.86,98.89 189.86,105.24 169.54,125.56 145.41,125.56 144.14,126.83 131.44,126.83 127,122.39 127,112.23 130.81,108.42 130.81,105.24 Q82.G
!PUN1  (via drill 0.61)
  Top 0.254: Q56.G 151.76,61.43 152.4,61.43 153.66,60.16 153.66,57.62 154.3,56.98 155.57,56.98 156.84,58.26 D88.C | v167,64.6 185.41,46.19 SV4.16
  Bottom 0.254: v167,64.6 155.57,64.6 152.4,61.43 151.76,61.43 Q56.G
!PUN2  (via drill 0.61)
  Top 0.254: Q84.G 141.6,104.61 142.24,104.61 143.5,103.34 143.5,100.8 144.14,100.16 145.41,100.16 146.68,101.43 D116.C | v182.24,96.35 184.78,98.89 SV2.12
  Bottom 0.254: v182.24,96.35 180.97,96.35 179.7,95.08 173.35,95.08 168.27,100.16 164.46,100.16 163.83,99.53 163.83,98.26 160.65,95.08 151.76,95.08 148.59,98.26 148.59,99.53 147.31,100.8 D116.C
!PUP1  (via drill 0.61)
  Top 0.254: D90.C 146.68,43.02 145.41,41.74 144.14,41.74 143.5,42.38 143.5,44.92 142.24,46.19 141.6,46.19 Q58.G 140.97,46.83 140.97,48.73 144.78,52.54 158.11,52.54 159.38,51.27 162.56,51.27 v163.83,52.54
  Bottom 0.254: v163.83,52.54 165.09,51.27 168.91,51.27 172.08,48.09 178.43,48.09 184.78,41.74 188.59,41.74 189.22,41.11 189.22,39.84 187.96,38.57 SV4.9
!PUP2  (via drill 0.61)
  Top 0.254: D118.C 136.52,116.67 135.25,115.4 133.98,115.4 133.34,116.04 133.34,118.58 132.08,119.85 131.44,119.85 Q86.G 130.81,120.48 130.81,122.39 130.17,123.02 128.9,123.02 128.27,122.39 v124.45,122.39 | v186.69,110.96 186.69,103.34 185.41,102.07 SV2.14
  Bottom 0.254: v186.69,110.96 170.18,127.47 147.31,127.47 146.05,128.74 130.81,128.74 v124.45,122.39
!PUR1
  Bottom 0.254: Q60.G 161.92,46.19 162.56,46.19 164.46,44.29 165.73,44.29 167,43.02 D92.C 168.27,43.02 169.54,43.02 173.35,39.2 186.05,39.2 187.32,40.48 SV4.11
!PUR2  (via drill 0.61)
  Top 0.254: Q88.G 151.76,119.85 152.4,119.85 153.66,118.58 153.66,116.04 154.3,115.4 155.57,115.4 156.84,116.67 D120.C 157.47,116.04 158.75,114.77 158.75,113.5 159.38,112.86 160.65,112.86 161.28,113.5 161.28,114.77 161.92,115.4 v166.37,115.4 | v173.35,111.59 180.97,103.97 184.78,103.97 SV2.16
  Bottom 0.254: v173.35,111.59 172.08,111.59 168.27,115.4 v166.37,115.4
!PUS1  (via drill 0.61)
  Top 0.254: Q62.G 141.6,61.43 142.24,61.43 143.5,60.16 143.5,57.62 144.14,56.98 145.41,56.98 146.68,58.26 D94.C | v165.09,52.54 163.19,50.63 158.75,50.63 158.11,51.27 v152.4,51.27
  Bottom 0.254: v165.09,52.54 165.73,51.91 169.54,51.91 172.72,48.73 179.06,48.73 183.51,44.29 186.05,44.29 187.32,43.02 SV4.13 | v152.4,51.27 148.59,55.08 148.59,56.35 147.31,57.62 D94.C
!PUS2  (via drill 0.61)
  Top 0.254: Q90.G 151.76,104.61 152.4,104.61 153.66,103.34 153.66,100.8 154.3,100.16 155.57,100.16 156.84,101.43 D122.C | v160.65,96.35 170.18,96.35 171.44,95.08 186.05,95.08 187.32,96.35 SV2.9
  Bottom 0.254: v160.65,96.35 158.75,98.26 158.75,99.53 157.47,100.8 D122.C
!PUT2
  Bottom 0.254: Q92.G 161.92,104.61 162.56,104.61 164.46,102.7 165.73,102.7 167,101.43 D124.C 168.27,101.43 172.08,97.62 186.05,97.62 187.32,98.89 SV2.11
!PUU1
  Bottom 0.254: 166.37,58.89 167,58.26 D96.C | 166.37,58.89 165.73,59.52 164.46,59.52 162.56,61.43 161.92,61.43 Q64.G | 166.37,58.89 166.37,55.08 167.63,53.81 179.06,53.81 187.32,45.55 SV4.15
!PUU2
  Top 0.254: Q94.G 141.6,119.85 142.24,119.85 143.5,118.58 143.5,116.04 144.14,115.4 145.41,115.4 146.68,116.67 D126.C
  Bottom 0.254: SV2.13 187.96,102.07 189.22,103.34 189.22,104.61 170.81,123.02 168.27,123.02 167.63,123.66 146.05,123.66 142.24,119.85 141.6,119.85 Q94.G
!PUV1  (via drill 0.61)
  Top 0.254: v167,65.88 185.41,84.29 185.41,85.56 SV2.2
  Bottom 0.254: 135.88,71.59 136.52,70.95 D98.C | 135.88,71.59 135.25,72.22 133.98,72.22 132.08,74.13 131.44,74.13 Q66.G | v167,65.88 137.79,65.88 135.88,67.78 135.88,71.59
!PUV2  (via drill 0.61)
  Top 0.254: v173.35,116.67 168.27,116.67 D128.C
  Bottom 0.254: Q96.G 161.92,119.85 162.56,119.85 164.46,117.94 165.73,117.94 167,116.67 D128.C | v173.35,116.67 174.62,116.67 187.32,103.97 SV2.15
+5V  (via drill 0.61)
  Top 0.254: IC9.OUT 198.12,125.56 198.12,123.02 5V.1 197.48,121.12 196.21,119.85 182.88,119.85 170.81,131.92 167,131.92 165.73,130.65 165.73,125.56 174.62,116.67 172.08,114.13 169.54,114.13 | 146.68,112.86 147.31,113.5 R317.1 | 146.68,112.86 146.05,112.23 139.69,112.23 137.79,114.13 R309.1 | 146.68,112.86 155.57,112.86 156.84,114.13 R311.1 157.47,113.5 158.75,112.23 165.09,112.23 167,114.13 R319.1 168.27,114.13 169.54,114.13 | 146.68,39.2 147.31,39.84 R281.1 | 146.68,39.2 146.05,38.57 138.43,38.57 137.16,39.84 R273.1 | 155.57,39.2 156.84,40.48 R275.1 | 155.57,39.2 146.68,39.2 | 155.57,39.2 165.73,39.2 167,40.48 R283.1 167.63,41.11 171.44,44.92 171.44,55.08 170.18,56.35 167.63,56.35 R287.1 167,55.72 165.09,53.81 158.75,53.81 | 145.41,8.73 139.06,8.73 137.79,10 R259.1 | 145.41,8.73 146.68,10 R267.1 | 155.57,8.73 156.84,10 R10.1 | 155.57,8.73 145.41,8.73 | 155.57,8.73 165.73,8.73 167,10 R265.1 167.63,10.63 168.91,11.9 168.91,23.33 167.63,24.6 R269.1 167,25.23 165.73,23.96 155.57,23.96 | 145.41,23.96 139.06,23.96 137.79,25.23 R263.1 | 145.41,23.96 146.68,25.23 R271.1 | 155.57,23.96 156.84,25.23 R261.1 | 155.57,23.96 145.41,23.96 | 147.31,55.08 146.05,53.81 139.69,53.81 137.79,55.72 R277.1 | 147.31,55.08 R285.1 147.31,55.08 | 158.75,53.81 157.47,55.08 R279.1 | 147.31,55.08 148.59,53.81 158.75,53.81 | v140.97,81.75 139.69,81.75 137.79,83.65 R293.1 | R301.1 158.11,83.65 159.38,82.38 165.73,82.38 167,83.65 R303.1 | 145.41,97.62 139.06,97.62 137.79,98.89 R305.1 | 145.41,97.62 146.68,98.89 R307.1 | 155.57,97.62 156.84,98.89 R313.1 | 155.57,97.62 145.41,97.62 | 155.57,97.62 165.73,97.62 167,98.89 R315.1 167.63,99.53 168.91,100.8 168.91,108.42 169.54,109.05 169.54,114.13
  Top 0.254: R297.1 156.84,68.41 155.57,67.14 151.76,67.14 151.12,67.78 151.12,69.05 150.49,69.68 149.22,69.68 147.95,68.41 R291.1
  Bottom 0.254: R283.1 167.63,39.84 168.91,38.57 168.91,27.14 167.63,25.87 R269.1 | R297.1 157.47,67.78 158.75,66.51 165.09,66.51 167,68.41 R299.1 167.63,67.78 167.63,66.51 170.18,63.97 170.18,58.89 167.63,56.35 R287.1 | R289.1 137.79,68.41 139.06,67.14 145.41,67.14 146.68,68.41 R291.1 147.31,69.05 146.05,70.32 146.05,71.59 145.41,72.22 144.14,72.22 143.5,72.86 143.5,81.75 | 143.5,81.75 144.78,81.75 146.68,83.65 R295.1 147.31,83.02 147.31,82.38 149.86,79.84 152.4,82.38 155.57,82.38 156.84,83.65 R301.1 | 143.5,81.75 v140.97,81.75 | R303.1 167.63,84.29 168.91,85.56 168.91,96.99 167.63,98.26 R315.1
-5V  (via drill 0.61)
  Top 0.254: R185.1 106.04,48.09 104.77,48.09 R183.2 103.5,48.09 102.23,49.37 92.07,49.37 | R169.1 95.88,48.09 94.61,48.09 R167.2 93.34,48.09 92.07,49.37 | R163.2 74.29,48.09 75.56,48.09 R165.1 76.83,48.09 78.1,49.37 78.73,49.37 | R181.1 85.72,48.09 84.45,48.09 R179.2 83.18,48.09 81.91,49.37 | 78.73,49.37 81.91,49.37 | 81.91,49.37 92.07,49.37 | R13.1 106.04,17.62 104.77,17.62 R2.2 103.5,17.62 102.23,18.89 92.07,18.89 | R153.1 95.88,17.62 94.61,17.62 R151.2 93.34,17.62 92.07,18.89 | R139.2 74.29,17.62 75.56,17.62 R141.1 76.83,17.62 78.1,18.89 81.91,18.89 | R8.1 85.72,17.62 84.45,17.62 R4.2 83.18,17.62 81.91,18.89 | 92.07,18.89 81.91,18.89 | R147.2 74.29,32.86 75.56,32.86 R149.1 76.83,32.86 78.1,34.12 81.91,34.12 83.18,32.86 R159.2 84.45,32.86 85.72,32.86 R161.1 86.99,32.86 89.53,35.4 92.7,35.4 95.25,32.86 | 95.25,32.86 95.88,32.86 R145.1 97.15,32.86 98.42,34.12 102.23,34.12 103.5,32.86 R155.2 104.77,32.86 106.04,32.86 R157.1 | 95.25,32.86 94.61,32.86 R143.2 | R225.1 106.04,91.27 104.77,91.27 R223.2 103.5,91.27 102.23,92.54 92.07,92.54 | R209.1 95.88,91.27 94.61,91.27 R207.2 93.34,91.27 92.07,92.54 | R203.2 74.29,91.27 75.56,91.27 R205.1 76.83,91.27 78.1,92.54 81.91,92.54 83.18,91.27 R219.2 84.45,91.27 85.72,91.27 R221.1 86.99,91.27 88.26,92.54 92.07,92.54 | R195.2 74.29,76.03 75.56,76.03 R197.1 76.83,76.03 78.1,77.3 81.91,77.3 83.18,76.03 R211.2 84.45,76.03 85.72,76.03 R213.1 86.99,76.03 88.26,74.77 93.34,74.77 | R193.1 106.04,63.34 104.77,63.34 R191.2 103.5,63.34 102.23,64.6 92.7,64.6 | R177.1 95.88,63.34 94.61,63.34 R175.2 93.34,63.34 92.7,63.97
  Top 0.254: R171.2 74.29,63.34 75.56,63.34 R173.1 76.2,63.97 77.47,65.24 82.55,65.24 83.18,64.6 | R189.1 85.72,63.34 84.45,63.34 R187.2 83.81,63.97 83.18,64.6 | 92.7,63.97 92.07,64.6 83.18,64.6 | 93.34,74.77 92.7,74.13 92.7,64.6 | 93.34,74.77 93.98,75.4 R199.2 94.61,76.03 95.88,76.03 R201.1 97.15,76.03 98.42,77.3 102.23,77.3 103.5,76.03 R215.2 | 92.7,64.6 92.7,63.97 | R239.2 94.61,121.75 95.88,121.75 R241.1 | R235.2 74.29,121.75 75.56,121.75 R237.1 76.83,121.75 78.1,123.02 81.91,123.02 83.18,121.75 R251.2 | R251.2 84.45,121.75 85.72,121.75 R253.1 | R249.1 106.04,106.52 104.77,106.52 R247.2 103.5,106.52 102.23,107.78 92.07,107.78 | R233.1 95.88,106.52 94.61,106.52 R231.2 93.34,106.52 92.07,107.78 | R227.2 74.29,106.52 75.56,106.52 R229.1 76.83,106.52 78.1,107.78 81.91,107.78 | R245.1 85.72,106.52 84.45,106.52 R243.2 83.18,106.52 81.91,107.78 | 82.55,107.78 81.91,107.78 | 82.55,107.78 92.07,107.78 | 82.55,107.78 82.55,119.85 83.81,121.12 R251.2 | R255.2 104.77,121.75 106.04,121.75 R257.1 | v78.73,58.26 78.73,49.37
  Bottom 0.254: R153.1 96.52,18.25 96.52,23.33 100.33,27.14 100.33,28.41 100.96,29.05 102.23,29.05 102.87,29.68 102.87,30.95 104.14,32.22 R155.2 | R165.1 76.83,48.09 80.64,44.29 81.91,44.29 82.55,43.65 82.55,34.76 83.81,33.49 R159.2 | R215.2 104.77,76.03 106.04,76.03 R217.1 | R195.2 73.66,76.67 71.75,78.57 71.75,90 73.02,91.27 R203.2 73.66,91.91 73.66,94.45 78.73,99.53 78.73,103.34 76.2,105.88 R229.1 | R239.2 93.34,121.75 92.07,123.02 88.26,123.02 86.99,121.75 R253.1 | IC10.OUT 179.7,147.79 144.14,147.79 142.87,149.06 116.84,149.06 107.95,140.17 107.95,123.66 106.68,122.39 R257.1 | R241.1 97.15,121.75 98.42,123.02 102.23,123.02 103.5,121.75 R255.2 | v78.73,58.26 78.73,60.16 76.2,62.7 R173.1
A1  (via drill 0.61)
  Top 0.254: 31.75,4.28 34.28,1.74 77.47,1.74 v81.91,6.18 86.99,11.27 Q4.D | 31.75,4.28 26.03,10 R3.1 | v114.3,142.71 93.98,142.71 v88.9,147.79 | v44.45,149.7 19.68,149.7 7.62,137.63 7.62,13.17 16.51,4.28 31.75,4.28 | v130.81,8.73 126.36,8.73 v121.28,13.81 | v101.59,3.01 85.09,3.01 v83.18,4.92
  Bottom 0.254: Q1.D 154.94,14.44 153.03,12.54 151.76,12.54 150.49,13.81 Q2.D 149.22,13.81 146.68,13.81 146.05,13.17 146.05,9.36 145.41,8.73 v130.81,8.73 | v114.3,142.71 111.76,140.17 SIDE1.10 | v88.9,147.79 50.16,147.79 48.25,149.7 v44.45,149.7 | v121.28,13.81 118.74,11.27 109.85,11.27 v101.59,3.01 | v81.91,6.18 v83.18,4.92
A2
  Top 0.254: A2.1 38.73,139.53 45.08,139.53 SIDE2.2
B1  (via drill 0.61)
  Top 0.254: Q5.D 76.83,11.27 69.84,11.27 58.41,22.7 40,22.7 33.02,15.71 R16.1 | Q35.D 134.62,14.44 132.71,12.54 131.44,12.54 130.17,13.81 Q36.D 128.9,13.81 126.36,16.35 118.74,16.35 117.47,15.08 121.92,10.63 | v119.38,145.25 115.56,141.44 109.22,141.44 107.31,139.53 SIDE1.6 | v193.67,114.13 v193.67,26.51 | v172.08,10 168.27,6.18 126.36,6.18 121.92,10.63 | v115.56,4.28 v85.09,4.28 | 121.92,10.63 v121.28,10
  Bottom 0.254: v119.38,145.25 162.56,145.25 v193.67,114.13 | v193.67,26.51 192.4,26.51 175.89,10 v172.08,10 | v85.09,4.28 78.1,11.27 Q5.D | v121.28,10 v115.56,4.28
B2
  Top 0.254: SIDE2.4 48.25,140.17 48.25,145.89 B2.1
C1  (via drill 0.61)
  Top 0.254: SIDE1.1 102.23,137 103.5,137 SIDE1.3 104.77,137 106.04,137 SIDE1.5 107.31,137 108.58,137 SIDE1.7 109.85,137 111.12,137 SIDE1.9 112.39,137 113.66,137 SIDE1.11 114.93,137 116.2,137 SIDE1.13 117.47,137 118.74,137 SIDE1.15 120.01,137 121.28,137 SIDE1.17 122.55,137 123.82,137 SIDE1.19 125.09,137 126.36,137 SIDE1.21 127.63,137 128.9,137 SIDE1.23 130.17,137 131.44,137 SIDE1.25 132.71,137 133.98,137 SIDE1.27 135.25,137 136.52,137 SIDE1.29 137.79,137 139.06,137 SIDE1.31 140.33,137 141.6,137 SIDE1.33 | Q38.D 150.49,29.05 151.76,27.78 153.03,27.78 154.94,29.68 Q37.D | v90.8,20.16 67.31,20.16 66.04,18.89 64.77,18.89 60.32,23.33 37.46,23.33 32.38,28.41 32.38,31.59 31.11,32.86 R20.1 | v145.41,36.03 135.88,36.03 v135.25,36.66 | v125.73,35.4 125.73,29.68 123.82,27.78 123.82,25.23 115.56,16.98 115.56,9.36 v114.93,8.73 113.66,7.46 92.07,7.46 90.17,9.36 v90.17,16.35 | v167,130.65 168.27,130.65 168.91,131.28 170.18,131.28 193.03,108.42 193.03,27.14 171.44,5.55 121.92,5.55 v118.74,8.73
  Bottom 0.254: Q6.D 97.15,26.51 v90.8,20.16 90.17,19.52 v90.17,16.35 | v145.41,36.03 147.95,33.49 147.95,32.86 149.86,30.95 149.86,29.68 Q38.D | v135.25,36.66 133.98,35.4 v125.73,35.4 | v167,130.65 160.65,137 142.87,137 SIDE1.33 | v118.74,8.73 v114.93,8.73
C2
  Top 0.254: C2.1 38.73,135.09 43.17,135.09 45.08,137 SIDE2.1 46.35,137 47.62,137 SIDE2.3 48.89,137 50.16,137 SIDE2.5 51.43,137 52.7,137 SIDE2.7 53.97,137 55.24,137 SIDE2.9 56.51,137 57.78,137 SIDE2.11 59.05,137 60.32,137 SIDE2.13 61.59,137 62.86,137 SIDE2.15 64.13,137 65.4,137 SIDE2.17 66.67,137 67.94,137 SIDE2.19 69.21,137 70.48,137 SIDE2.21 71.75,137 73.02,137 SIDE2.23 74.29,137 75.56,137 SIDE2.25 76.83,137 78.1,137 SIDE2.27 79.37,137 80.64,137 SIDE2.29 81.91,137 83.18,137 SIDE2.31 84.45,137 85.72,137 SIDE2.33
D1  (via drill 0.61)
  Top 0.254: 66.67,23.96 69.21,26.51 76.83,26.51 Q7.D | 66.67,23.96 64.77,23.96 v56.51,32.22 | v116.84,147.79 110.48,147.79 108.58,149.7 45.71,149.7 41.9,145.89 17.14,145.89 8.25,137 8.25,41.74 v14.6,35.4 | v22.22,35.4 24.76,32.86 R24.1 | v120.65,18.25 129.53,27.14 129.53,28.41 Q40.D | v102.87,26.51 102.87,24.6 102.23,23.96 66.67,23.96
  Bottom 0.254: Q40.D 130.17,29.05 131.44,27.78 132.71,27.78 134.62,29.68 Q39.D | v56.51,32.22 54.6,34.12 27.3,34.12 26.03,32.86 R24.1 | v116.84,147.79 109.22,140.17 SIDE1.8 | v14.6,35.4 v22.22,35.4 | v120.65,18.25 120.65,14.44 119.38,13.17 115.56,13.17 112.39,16.35 100.96,16.35 100.33,16.98 100.33,25.87 100.96,26.51 v102.87,26.51
D2  (via drill 0.61)
  Top 0.254: Q68.D 139.69,71.59 139.69,70.32 140.97,69.05 140.97,67.78 141.6,67.14 145.41,67.14 146.05,67.78 146.05,69.05 145.41,69.68 144.14,69.68 143.5,70.32 143.5,71.59 144.78,72.86 Q67.D | 103.5,78.57 105.41,76.67 105.41,75.4 104.77,74.77 100.96,74.77 99.06,72.86 99.06,71.59 97.79,70.32 Q20.D | 103.5,78.57 102.23,79.84 73.02,79.84 72.39,79.21 v70.48,79.21 38.09,79.21 33.02,74.13 R80.1 | v62.22,138.27 52.7,138.27 51.43,139.53 SIDE2.6 | v63.49,126.83 62.22,125.56 66.67,121.12 66.67,112.23 67.94,110.96 67.94,100.16 69.21,98.89 v69.21,90 | v117.47,92.54 v123.82,92.54 | v109.85,86.19 109.85,84.92 103.5,78.57
  Bottom 0.254: v62.22,138.27 62.22,128.11 v63.49,126.83 | v69.21,90 69.21,88.73 70.48,87.46 v70.48,79.21 | v123.82,92.54 127,89.37 127,84.29 128.9,82.38 130.81,82.38 137.16,76.03 137.16,75.4 139.69,72.86 Q68.D | v117.47,92.54 112.39,87.46 111.12,87.46 v109.85,86.19
E1  (via drill 0.61)
  Top 0.254: Q42.D 160.65,13.81 161.92,12.54 163.19,12.54 165.09,14.44 Q41.D 165.09,15.71 165.09,16.98 162.56,19.52 v130.81,19.52 | v125.09,19.52 v128.27,19.52
  Bottom 0.254: 97.79,1.74 57.14,1.74 48.89,10 R28.1 | 97.79,1.74 107.31,11.27 Q3.D | 132.08,1.74 97.79,1.74 | 132.08,1.74 173.99,1.74 197.48,25.23 197.48,109.05 161.92,144.62 120.01,144.62 114.93,139.53 SIDE1.12 | v128.27,19.52 v130.81,19.52 | v125.09,19.52 125.09,8.73 132.08,1.74
E2  (via drill 0.61)
  Top 0.254: Q21.D 76.83,84.92 67.94,84.92 64.77,81.75 v57.78,81.75 37.46,81.75 33.02,86.19 33.02,90 31.75,91.27 31.11,91.27 R84.1 | v19.05,132.55 19.05,131.28 10.15,122.39 10.15,96.99 v13.96,93.18 | v130.81,79.84 130.81,84.29 129.53,85.56 129.53,86.83 Q70.D | v126.36,77.3 126.36,72.22 v122.55,68.41 | v98.42,54.45 v107.31,54.45 | v62.22,66.51 v62.22,60.8 | v57.78,76.03 v57.78,70.95
  Bottom 0.254: Q70.D 130.17,87.46 131.44,86.19 132.71,86.19 134.62,88.1 Q69.D | v19.05,132.55 22.86,136.36 37.46,136.36 39.36,138.27 51.43,138.27 52.7,139.53 SIDE2.8 | v13.96,93.18 27.94,93.18 29.84,91.27 R84.1 | v130.81,79.84 130.81,79.21 131.44,78.57 130.17,77.3 v126.36,77.3 | v122.55,68.41 122.55,67.14 112.39,56.98 109.85,56.98 v107.31,54.45 | v98.42,54.45 96.52,52.54 74.93,52.54 74.29,51.91 71.12,51.91 v62.22,60.8 | v57.78,70.95 v62.22,66.51 | v57.78,81.75 v57.78,76.03
F1  (via drill 0.61)
  Top 0.254: v127.63,110.32 v127.63,27.78 116.2,16.35 116.2,8.73 113.03,5.55 v99.06,5.55
  Bottom 0.254: 95.25,9.36 88.26,2.38 69.21,2.38 56.51,15.08 R32.1 | 95.25,9.36 97.15,11.27 Q8.D | Q43.D 144.78,14.44 142.87,12.54 141.6,12.54 140.33,13.81 Q44.D 139.69,14.44 139.69,15.08 136.52,18.25 134.62,18.25 127.63,25.23 v127.63,27.78 | v127.63,110.32 118.11,119.85 118.11,137.63 116.84,138.9 SIDE1.14 | v99.06,5.55 95.25,9.36
F2  (via drill 0.61)